# EAGLE design STM32L441CE_4L_connector (EAGLE 9.6.2)
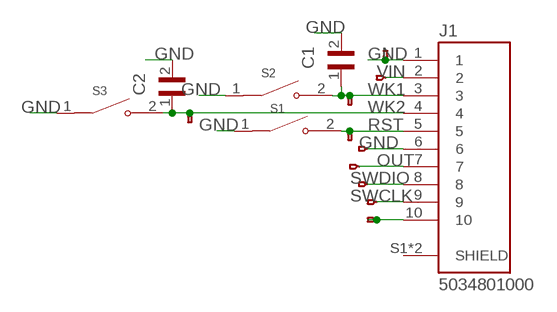
[diagram p0: schematic, sheet 1]

## Parts
C1  GRM033C80J104KE15D  [CAPC0603X33N]
C2  GRM033C80J104KE15D  [CAPC0603X33N]
J1  5034801000  [MOLEX_5034801000]
JP1  HEADERHOLE-HEADERHOLE  [1X1-HEADER-HOLE]
JP2  HEADERHOLE-HEADERHOLE  [1X1-HEADER-HOLE]
JP3  HEADERHOLE-HEADERHOLE  [1X1-HEADER-HOLE]
JP4  HEADERHOLE-HEADERHOLE  [1X1-HEADER-HOLE]
JP5  HEADERHOLE-HEADERHOLE  [1X1-HEADER-HOLE]
JP6  HEADERHOLE-HEADERHOLE  [1X1-HEADER-HOLE]
JP7  HEADERHOLE-HEADERHOLE  [1X1-HEADER-HOLE]
JP8  HEADERHOLE-HEADERHOLE  [1X1-HEADER-HOLE]
JP9  HEADERHOLE-HEADERHOLE  [1X1-HEADER-HOLE]
JP10  HEADERHOLE-HEADERHOLE  [1X1-HEADER-HOLE]
S1  B3U-1000P  [SW_B3U-1000P]
S2  B3U-1000P  [SW_B3U-1000P]
S3  B3U-1000P  [SW_B3U-1000P]

## Nets
GND: C1.2 C2.2 J1.1 J1.6 JP1.1 JP10.1 S1.1 S2.1 S3.1
N$10: J1.10 JP5.1
OUT: J1.7 JP2.1
RST: J1.5 JP6.1 S1.2
SWCLK: J1.9 JP4.1
SWDIO: J1.8 JP3.1
VIN: J1.2 JP9.1
WK1: C1.1 J1.3 JP8.1 S2.2
WK2: C2.1 J1.4 JP7.1 S3.2
Unconnected: J1.S1(SHIELD) J1.S2(SHIELD)

## Library data of the parts
C1 C2 = GRM033C80J104KE15D:GRM033C80J104KE15D: .1UF 6.3V 10% 0201; DESCRIPTION: SMD Capacitor X6S(EIA) with Capacitance: 0.10uF Tol. 10%. Rated Voltage: 6.3Vdc; DIGI-KEY_PART_NUMBER: 490-10390-1-ND; DIGIKEY-PURCHASE-URL: https://snapeda.com/shop?store=DigiKey&id=1836969; MF: Murata Electronics; MP: GRM033C80J104KE15D; PACKAGE: 0603 Taiyo Yuden
J1 = 5034801000:5034801000: 0.50mm Pitch Easy-On™ BackFlip™ Type FPC Connector, 1.00mm Height, Right Angle, Surface Mount, Dual Contact Style; DESCRIPTION: 10 Position FFC, FPC Connector Contacts, Top and Bottom 0.020 (0.50mm) Surface Mount, Right Angle; DIGI-KEY_PART_NUMBER: WM1389CT-ND; MF: Molex; MP: 5034801000; PACKAGE: None; PURCHASE-URL: https://pricing.snapeda.com/search/part/5034801000/?ref=eda
JP1-JP10 = F405Pill:HEADERHOLE
S1-S3 = B3U-1000P:B3U-1000P: Switch Tactile N.O. SPST Round Button Gull Wing 0.05A 12VDC 1.5N SMD Embossed T/R; DESCRIPTION: Tactile Switch SPST-NO Top Actuated Surface Mount; DIGI-KEY_PART_NUMBER: SW1020CT-ND; DIGIKEY-PURCHASE-URL: https://snapeda.com/shop?store=DigiKey&id=104326; MF: Omron; MP: B3U-1000P; PACKAGE: None

## Board
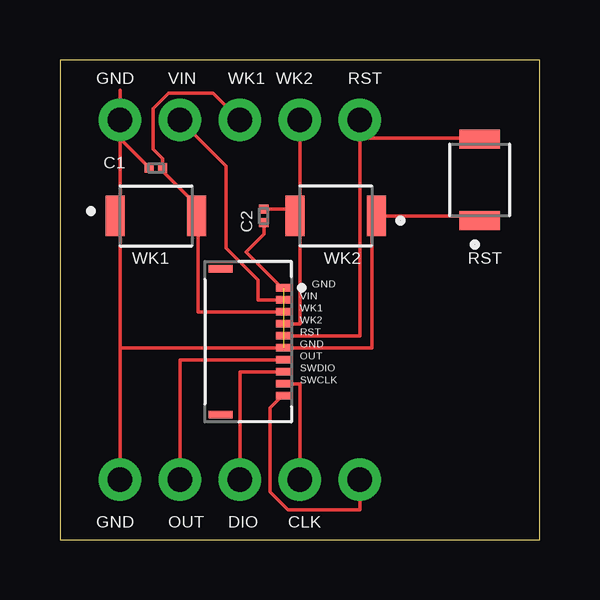
[diagram p1: board, top side]

Size 20 x 20 mm. Coordinates in mm from the lower left corner, seen from the top.
Outline: 0,0 20,0 20,20 0,20 0,0
Copper layers (1*16): Top 0.035mm / dielectric 1.5mm / Bottom 0.035mm
Design rules "default": minimum track width 6mil, minimum drill 0.35mm, track to track 6mil, track to pad 6mil, pad to pad 6mil, via to via 6mil, smd to smd 6mil, copper to edge 40mil, drill to drill 6mil, minimum pad ring 10mil, minimum via ring 8mil, stop-mask expansion 4mil, vias tented up to drill 0mil, thermal gap 10mil

### Footprints (pad centres in the part's own frame; a part is rotated, then mirrored left to right if it is on the bottom)
CAPC0603X33N = smd 0.38 x 0.4: 1 -0.281,0; 2 0.281,0
MOLEX_5034801000 = smd 0.3 x 0.7: 1 -2.25,0; 2 -1.75,0; 3 -1.25,0; 4 -0.75,0; 5 -0.25,0; 6 0.25,0; 7 0.75,0; 8 1.25,0; 9 1.75,0; 10 2.25,0 | smd 0.3 x 1: S1 -3.04,-2.65; S2 3.04,-2.65
1X1-HEADER-HOLE = drill 1.016 pad 1.778: 1 0,0
SW_B3U-1000P = smd 0.8 x 1.7: 1 -1.7,0; 2 1.7,0

### Placement (x,y rotation side)
C1  4,15.5 180 top
C2  8.5,13.5 270 top
J1  9.35,8.25 270 top
JP1  2.5,17.5 0 top
JP2  5,2.5 0 top
JP3  7.5,2.5 0 top
JP4  10,2.5 0 top
JP5  12.5,2.5 0 top
JP6  12.5,17.5 0 top
JP7  10,17.5 0 top
JP8  7.5,17.5 0 top
JP9  5,17.5 0 top
JP10  2.5,2.5 0 top
S1  17.5,15 90 top
S2  4,13.5 0 top
S3  11.5,13.5 180 top

### Tracks (layer width: path | path; a pad name or v marks a point on that pad's centre or on a via)
GND  (1 unrouted)
  Top 0.152: S1.1 17.5,13.5 S3.1 13,13.5 13,8 9.5,8 J1.6 9.25,8 2.5,8 | J1.1 9.25,10.5 7.75,12 8.5,12.75 C2.2 | 2.5,13.5 JP1.1 2.5,18.75 2.5,16.73 C1.2 | 2.5,13.5 2.5,8 | 2.5,8 JP10.1 | 2.5,13.5 S2.1
N$10
  Top 0.152: JP5.1 12.5,1.25 9.5,1.25 8.75,2 8.75,5.5 9.25,6 J1.10
OUT
  Top 0.152: JP2.1 5,7.5 9.25,7.5 J1.7
RST
  Top 0.152: 12.5,16.75 12.5,8.5 9.5,8.5 J1.5 | 12.5,16.75 17.5,16.75 S1.2 | 12.5,16.75 JP6.1
SWCLK
  Top 0.152: JP4.1 10,6.5 9.5,6.5 J1.9
SWDIO
  Top 0.152: JP3.1 7.5,7 9.25,7 J1.8
VIN
  Top 0.152: J1.2 9.25,10 8.25,10 8.25,10.5 8.25,10.83 6.92,12.15 6.92,15.57 JP9.1
WK1
  Top 0.152: J1.3 9.25,9.5 5.75,9.5 5.75,13.5 S2.2 5.7,13.95 4.28,15.37 C1.1 4.28,15.89 3.88,16.29 3.88,17.96 4.54,18.62 6.38,18.62 JP8.1
WK2
  Top 0.152: 9.75,13 9.75,13.5 S3.2 | 10,13.5 10,9 9.5,9 J1.4 | JP7.1 10,13.5 | 10,13.5 S3.2 | C2.1 9.52,13.78 S3.2

### Text on the board
tNames: GND | VIN | WK1 | WK2 | RST | WK1 | WK2 | RST | VIN | WK1 | GND | WK2 | GND | OUT | RST | SWDIO | SWCLK | GND | OUT | DIO | CLK